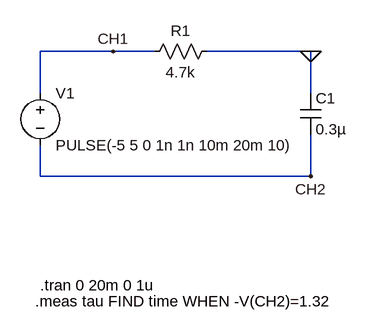
[diagram p0: schematic RC5pp.asc]
RC5pp.asc, the LTspice schematic file:
Version 4
SHEET 1 880 680
WIRE 208 48 96 48
WIRE 272 48 208 48
WIRE 512 48 352 48
WIRE 96 112 96 48
WIRE 512 112 512 48
WIRE 96 240 96 192
WIRE 512 240 512 176
WIRE 512 240 96 240
FLAG 512 48 0
FLAG 208 48 CH1
FLAG 512 240 CH2
SYMBOL voltage 96 96 R0
WINDOW 123 0 0 Left 0
WINDOW 39 0 0 Left 0
SYMATTR InstName V1
SYMATTR Value PULSE(-5 5 0 1n 1n 10m 20m 10)
SYMBOL res 368 32 R90
WINDOW 0 0 56 VBottom 2
WINDOW 3 32 56 VTop 2
SYMATTR InstName R1
SYMATTR Value 4.7k
SYMBOL cap 496 112 R0
SYMATTR InstName C1
SYMATTR Value 0.3µ
TEXT 96 408 Left 2 !.tran 0 20m 0 1u
TEXT 88 432 Left 2 !.meas tau FIND time WHEN -V(CH2)=1.32

The netlist it stands for:
* RC5pp.asc
V1 CH1 CH2 PULSE(-5 5 0 1n 1n 10m 20m 10)
R1 0 CH1 4.7k
C1 0 CH2 0.3µ
.tran 0 20m 0 1u
.meas tau FIND time WHEN -V(CH2)=1.32
.backanno
.end